# Altium schematic sheet 02-bluetooth-V2.3.SchDoc
size A4; Organization: Protel International P/L; Address1: L3, 12a Rodborough Rd; Address2: Frenchs Forest; Address3: NSW; Address4: Australia 2086
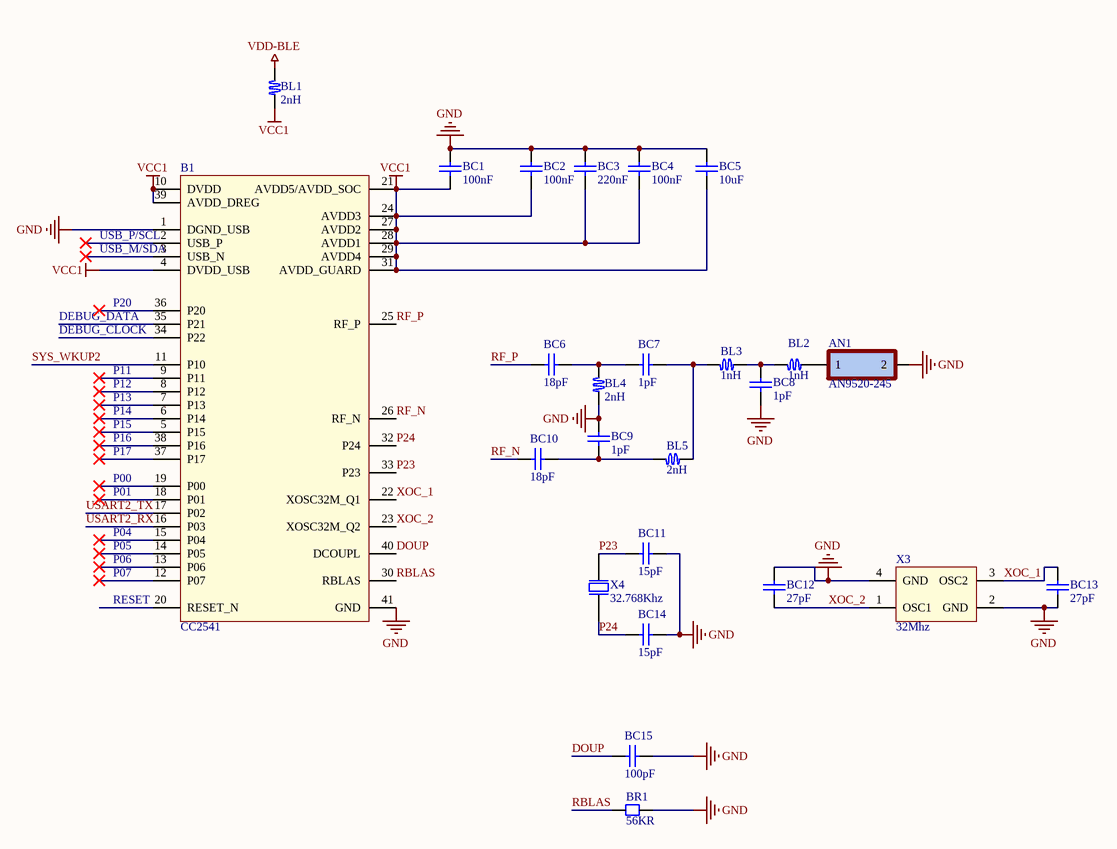
[diagram p0: 02-bluetooth-V2.3.SchDoc]

## Parts
AN1  AN9520-245  [AN-5120]
B1  CC2541  [QFN40-CC254X]
BC1  100nF  [CC1005-0402]
BC2  100nF  [CC1005-0402]
BC3  220nF  [CC1005-0402]
BC4  100nF  [CC1005-0402]
BC5  10uF  [CC1005-0402]
BC6  18pF  [CC1005-0402]
BC7  1pF  [CC1005-0402]
BC8  1pF  [CC1005-0402]
BC9  1pF  [CC1005-0402]
BC10  18pF  [CC1005-0402]
BC11  15pF  [CC1005-0402]
BC12  27pF  [CC1005-0402]
BC13  27pF  [CC1005-0402]
BC14  15pF  [CC1005-0402]
BC15  100pF  [CC1005-0402]
BL1  2nH  [Inductor-0402]
BL2  1nH  [Inductor-0402]
BL3  1nH  [Inductor-0402]
BL4  2nH  [Inductor-0402]
BL5  2nH  [Inductor-0402]
BR1  56KR  [CR1005-0402]
X3  32Mhz  [XTAL-2016]
X4  32.768Khz  [XTAL-2012]

## Nets
GND: AN1.2 B1.1(DGND_USB) B1.41(GND) BC1.2 BC2.2 BC3.2 BC4.2 BC5.2 BC8.1 BC9.1 BC11.2 BC12.2 BC13.1 BC14.2 BC15.1 BL4.1 BR1.2 X3.2(GND) X3.4(GND)
VCC1: B1.4(DVDD_USB) B1.10(DVDD) B1.21(AVDD5/AVDD_SOC) B1.24(AVDD3) B1.27(AVDD2) B1.28(AVDD1) B1.29(AVDD4) B1.31(AVDD_GUARD) B1.39(AVDD_DREG) BC1.1 BC2.1 BC3.1 BC4.1 BC5.1 BL1.1
VDD-BLE: BL1.2
DEBUG_CLOCK: B1.34(P22)
DEBUG_DATA: B1.35(P21)
DOUP: B1.40(DCOUPL) BC15.2
P00: B1.19(P00)
P01: B1.18(P01)
P04: B1.15(P04)
P05: B1.14(P05)
P06: B1.13(P06)
P07: B1.12(P07)
P11: B1.9(P11)
P12: B1.8(P12)
P13: B1.7(P13)
P14: B1.6(P14)
P15: B1.5(P15)
P16: B1.38(P16)
P17: B1.37(P17)
P20: B1.36(P20)
P23: B1.33(P23) BC11.1 X4.2
P24: B1.32(P24) BC14.1 X4.1
RBLAS: B1.30(RBLAS) BR1.1
RESET: B1.20(RESET_N)
RF_N: B1.26(RF_N) BC10.2
RF_P: B1.25(RF_P) BC6.2
SYS_WKUP2: B1.11(P10)
USART2_RX: B1.16(P03)
USART2_TX: B1.17(P02)
USB_M/SDA: B1.3(USB_N)
USB_P/SCL: B1.2(USB_P)
XOC_1: B1.22(XOSC32M_Q1) BC13.2 X3.3(OSC2)
XOC_2: B1.23(XOSC32M_Q2) BC12.1 X3.1(OSC1)
NetAN1_1: AN1.1 BL2.1
NetBC6_1: BC6.1 BC7.1 BL4.2
NetBC7_2: BC7.2 BL3.2 BL5.1
NetBC8_2: BC8.2 BL2.2 BL3.1
NetBC9_2: BC9.2 BC10.1 BL5.2

## Notes on the sheet
- Title
- Size:
- Date:
- A4
- Number:
- Time:
- Revision:
- Sheet
- of
- File:

## Library data of the parts
AN1 = AN9520-245: 2.4G全向天线 蓝牙天线 陶瓷贴片 WIFI内置
B1 = CC2541: 低功耗蓝牙芯片
BC1-BC15 = Chip capacitor: 贴片电容
BL1-BL5 = Inductor-0402: 0402封装的电感
BR1 = Chip resistor: 贴片电阻
X3 = XTAL 2016: 2016封装的晶振
X4 = XTAL 2012: 2012封装的时钟晶振